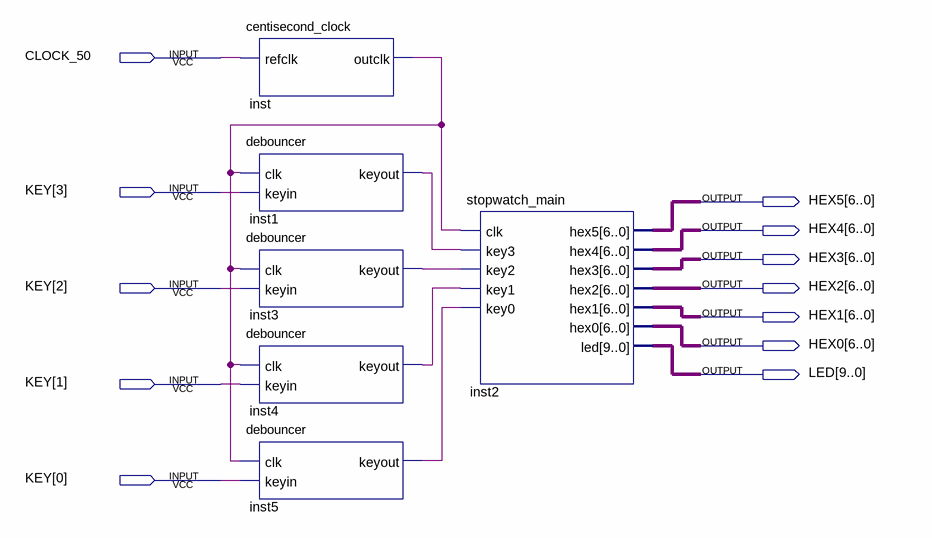
[diagram p0: schematic sheet]
// Quartus schematic stopwatch.bdf as structural Verilog: 6 symbols, 12 pins
module stopwatch (
  input  CLOCK_50,
  input  [3:0] KEY,
  output [6:0] HEX5,
  output [6:0] HEX4,
  output [6:0] HEX3,
  output [6:0] HEX2,
  output [6:0] HEX1,
  output [6:0] HEX0,
  output [9:0] LED
);

  wire inst1_keyout, inst3_keyout, inst4_keyout, inst5_keyout, inst_outclk;

  centisecond_clock inst (.refclk(CLOCK_50), .outclk(inst_outclk));
  debouncer inst1 (.clk(inst_outclk), .keyin(KEY[3]), .keyout(inst1_keyout));
  debouncer inst3 (.clk(inst_outclk), .keyin(KEY[2]), .keyout(inst3_keyout));
  debouncer inst4 (.clk(inst_outclk), .keyin(KEY[1]), .keyout(inst4_keyout));
  debouncer inst5 (.clk(inst_outclk), .keyin(KEY[0]), .keyout(inst5_keyout));
  stopwatch_main inst2 (
    .clk(inst_outclk), .key3(inst1_keyout), .key2(inst3_keyout), .key1(inst4_keyout), .key0(inst5_keyout),
    .hex5(HEX5), .hex4(HEX4), .hex3(HEX3), .hex2(HEX2), .hex1(HEX1), .hex0(HEX0), .led(LED));
endmodule
